# Altium schematic sheet SHIELD_W5500.SchDoc: W5500 ETHERNET SHIELD
size A3; DrawnBy: Aytac Dilek; Revision: V1.0
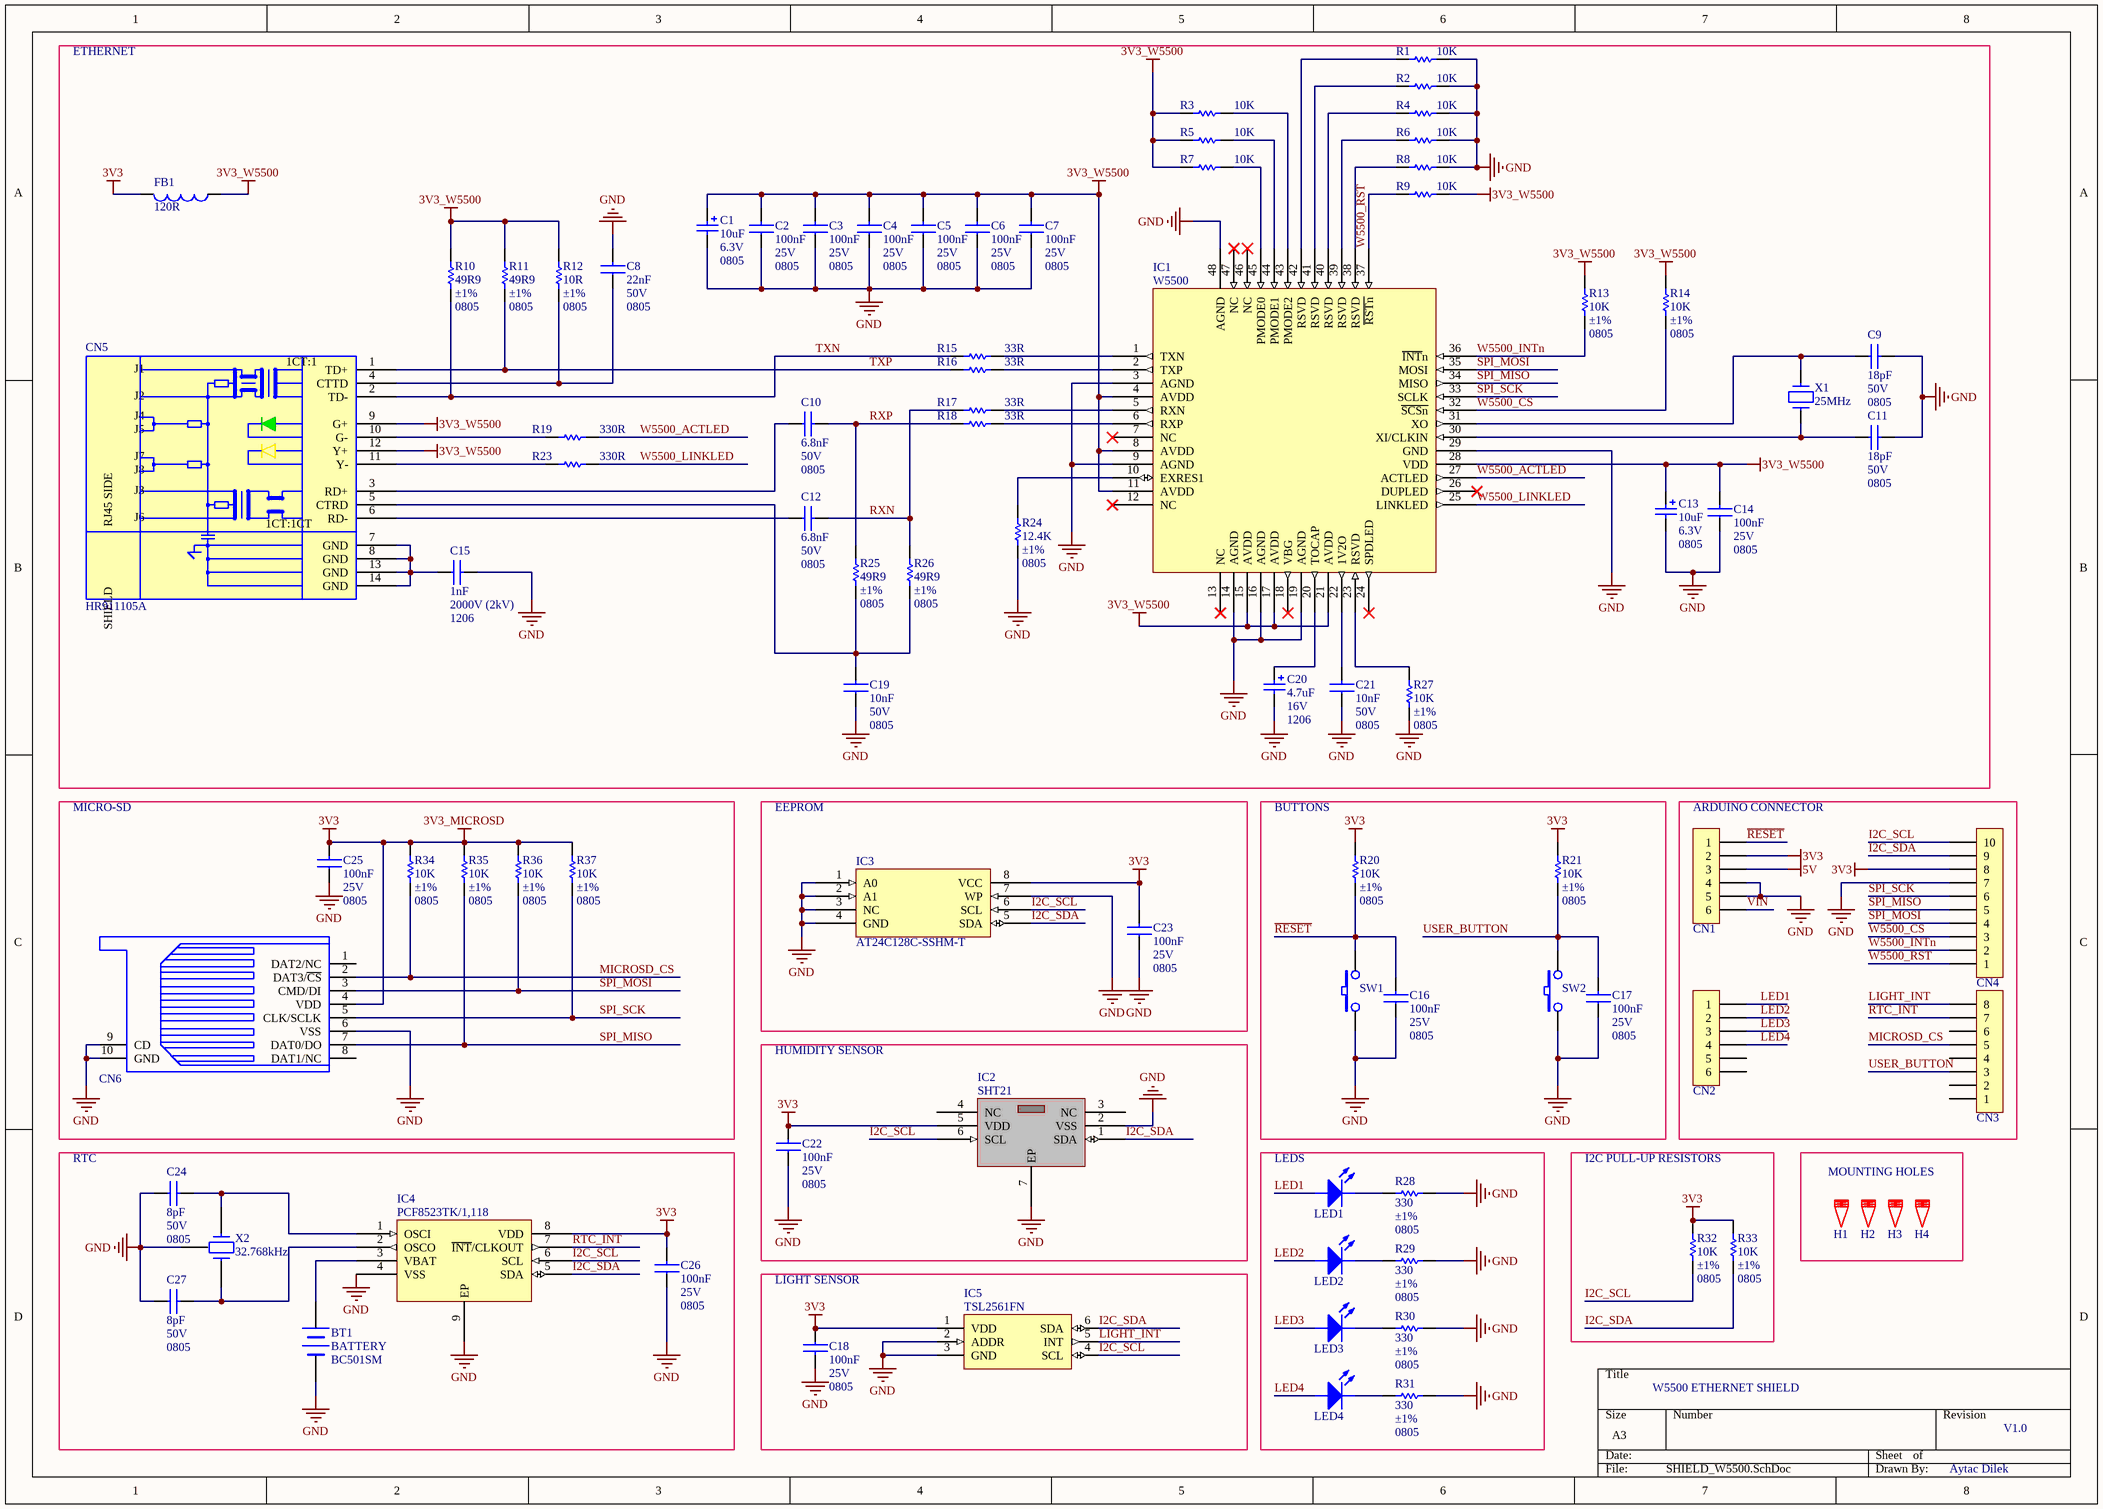
[diagram p0: SHIELD_W5500.SchDoc]

## Parts
BT1  BATTERY  Manufacturer Part Number: BC501SM  [MPD_BC501SM]
C1  value 10uF  Voltage - Rated: 6.3V  Package / Case: 0805  [CAPMP2013X12N_EIA-0805_CASE-R]  (hidden comment: CAP_P)
C2  Capacitance: 100nF  Voltage - Rated: 25V  Package / Case: 0805  [CAPC2012X100N_EIA0805]  (hidden comment: CAP_NP)
C3  Capacitance: 100nF  Voltage - Rated: 25V  Package / Case: 0805  [CAPC2012X100N_EIA0805]  (hidden comment: CAP_NP)
C4  Capacitance: 100nF  Voltage - Rated: 25V  Package / Case: 0805  [CAPC2012X100N_EIA0805]  (hidden comment: CAP_NP)
C5  Capacitance: 100nF  Voltage - Rated: 25V  Package / Case: 0805  [CAPC2012X100N_EIA0805]  (hidden comment: CAP_NP)
C6  Capacitance: 100nF  Voltage - Rated: 25V  Package / Case: 0805  [CAPC2012X100N_EIA0805]  (hidden comment: CAP_NP)
C7  Capacitance: 100nF  Voltage - Rated: 25V  Package / Case: 0805  [CAPC2012X100N_EIA0805]  (hidden comment: CAP_NP)
C8  Capacitance: 22nF  Voltage - Rated: 50V  Package / Case: 0805  [CAPC2012X100N_EIA0805]  (hidden comment: CAP_NP)
C9  Capacitance: 18pF  Voltage - Rated: 50V  Package / Case: 0805  [CAPC2012X100N_EIA0805]  (hidden comment: CAP_NP)
C10  Capacitance: 6.8nF  Voltage - Rated: 50V  Package / Case: 0805  [CAPC2012X100N_EIA0805]  (hidden comment: CAP_NP)
C11  Capacitance: 18pF  Voltage - Rated: 50V  Package / Case: 0805  [CAPC2012X100N_EIA0805]  (hidden comment: CAP_NP)
C12  Capacitance: 6.8nF  Voltage - Rated: 50V  Package / Case: 0805  [CAPC2012X100N_EIA0805]  (hidden comment: CAP_NP)
C13  value 10uF  Voltage - Rated: 6.3V  Package / Case: 0805  [CAPMP2013X12N_EIA-0805_CASE-R]  (hidden comment: CAP_P)
C14  Capacitance: 100nF  Voltage - Rated: 25V  Package / Case: 0805  [CAPC2012X100N_EIA0805]  (hidden comment: CAP_NP)
C15  value 1nF  Voltage - Rated: 2000V (2kV)  Package / Case: 1206  [CAPC3216X125N_EIA1206]  (hidden comment: CAP_NP)
C16  Capacitance: 100nF  Voltage - Rated: 25V  Package / Case: 0805  [CAPC2012X100N_EIA0805]  (hidden comment: CAP_NP)
C17  Capacitance: 100nF  Voltage - Rated: 25V  Package / Case: 0805  [CAPC2012X100N_EIA0805]  (hidden comment: CAP_NP)
C18  Capacitance: 100nF  Voltage - Rated: 25V  Package / Case: 0805  [CAPC2012X100N_EIA0805]  (hidden comment: CAP_NP)
C19  Capacitance: 10nF  Voltage - Rated: 50V  Package / Case: 0805  [CAPC2012X100N_EIA0805]  (hidden comment: CAP_NP)
C20  value 4.7uF  Voltage - Rated: 16V  Package / Case: 1206  [CAPMP3216X16N_EIA-1206_CASE-A]  (hidden comment: CAP_P)
C21  Capacitance: 10nF  Voltage - Rated: 50V  Package / Case: 0805  [CAPC2012X100N_EIA0805]  (hidden comment: CAP_NP)
C22  Capacitance: 100nF  Voltage - Rated: 25V  Package / Case: 0805  [CAPC2012X100N_EIA0805]  (hidden comment: CAP_NP)
C23  Capacitance: 100nF  Voltage - Rated: 25V  Package / Case: 0805  [CAPC2012X100N_EIA0805]  (hidden comment: CAP_NP)
C24  Capacitance: 8pF  Voltage - Rated: 50V  Package / Case: 0805  [CAPC2012X100N_EIA0805]  (hidden comment: CAP_NP)
C25  Capacitance: 100nF  Voltage - Rated: 25V  Package / Case: 0805  [CAPC2012X100N_EIA0805]  (hidden comment: CAP_NP)
C26  Capacitance: 100nF  Voltage - Rated: 25V  Package / Case: 0805  [CAPC2012X100N_EIA0805]  (hidden comment: CAP_NP)
C27  Capacitance: 8pF  Voltage - Rated: 50V  Package / Case: 0805  [CAPC2012X100N_EIA0805]  (hidden comment: CAP_NP)
CN1  HDR_1X6  [HDRFV6W70P254_1X6_1524X254X1118P]  (value not drawn)
CN2  HDR_1X6  [HDRFV6W70P254_1X6_1524X254X1118P]  (value not drawn)
CN3  HDR_1X8  [HDRFV8W70P254_1X8_2032X254X1118P]  (value not drawn)
CN4  HDR_1X10  [HDRFV10W70P254_1X10_2540X254X1118P]  (value not drawn)
CN5  HR911105A  [HANRUN_HR911105A]
CN6  MICRO-SD  [MICRO-SD-SELF-EJECT]  (value not drawn)
FB1  Impedance: 120R  [FILC2012X100N_EIA0805]  (hidden comment: BEAD)
H1  HOLES  [HOLE_125MIL]  (value not drawn)
H2  HOLES  [HOLE_125MIL]  (value not drawn)
H3  HOLES  [HOLE_125MIL]  (value not drawn)
H4  HOLES  [HOLE_125MIL]  (value not drawn)
IC1  W5500  [QFP50P900X900X160-48N]
IC2  SHT21  [SHT21]
IC3  Manufacturer Part Number: AT24C128C-SSHM-T  [SOIC127P600X175-8N]  (hidden comment: AT24C128)
IC4  PCF8523TK/1,118  [SON80P400X100_HS-9N_[NXP]SOT909-1]
IC5  Manufacturer Part Number: TSL2561FN  [DFN-6]  (hidden comment: TSL256x)
LED1  LED  [LEDC2012X70N_EIA0805_RED]  (value not drawn)
LED2  LED  [LEDC2012X70N_EIA0805_RED]  (value not drawn)
LED3  LED  [LEDC2012X70N_EIA0805_RED]  (value not drawn)
LED4  LED  [LEDC2012X70N_EIA0805_RED]  (value not drawn)
R1  value 10K  [RESC2013X65N_EIA0805]  (hidden comment: RES)
R2  value 10K  [RESC2013X65N_EIA0805]  (hidden comment: RES)
R3  value 10K  [RESC2013X65N_EIA0805]  (hidden comment: RES)
R4  value 10K  [RESC2013X65N_EIA0805]  (hidden comment: RES)
R5  value 10K  [RESC2013X65N_EIA0805]  (hidden comment: RES)
R6  value 10K  [RESC2013X65N_EIA0805]  (hidden comment: RES)
R7  value 10K  [RESC2013X65N_EIA0805]  (hidden comment: RES)
R8  value 10K  [RESC2013X65N_EIA0805]  (hidden comment: RES)
R9  value 10K  [RESC2013X65N_EIA0805]  (hidden comment: RES)
R10  value 49R9  Tolerance: ±1%  Package / Case: 0805  [RESC2013X65N_EIA0805]  (hidden comment: RES)
R11  value 49R9  Tolerance: ±1%  Package / Case: 0805  [RESC2013X65N_EIA0805]  (hidden comment: RES)
R12  value 10R  Tolerance: ±1%  Package / Case: 0805  [RESC2013X65N_EIA0805]  (hidden comment: RES)
R13  value 10K  Tolerance: ±1%  Package / Case: 0805  [RESC2013X65N_EIA0805]  (hidden comment: RES)
R14  value 10K  Tolerance: ±1%  Package / Case: 0805  [RESC2013X65N_EIA0805]  (hidden comment: RES)
R15  value 33R  [RESC2013X65N_EIA0805]  (hidden comment: RES)
R16  value 33R  [RESC2013X65N_EIA0805]  (hidden comment: RES)
R17  value 33R  [RESC2013X65N_EIA0805]  (hidden comment: RES)
R18  value 33R  [RESC2013X65N_EIA0805]  (hidden comment: RES)
R19  value 330R  [RESC2013X65N_EIA0805]  (hidden comment: RES)
R20  Resistance (Ohm): 10K  Tolerance: ±1%  Package / Case: 0805  [RESC2013X65N_EIA0805]  (hidden comment: RES)
R21  Resistance (Ohm): 10K  Tolerance: ±1%  Package / Case: 0805  [RESC2013X65N_EIA0805]  (hidden comment: RES)
R23  value 330R  [RESC2013X65N_EIA0805]  (hidden comment: RES)
R24  value 12.4K  Tolerance: ±1%  Package / Case: 0805  [RESC2013X65N_EIA0805]  (hidden comment: RES)
R25  value 49R9  Tolerance: ±1%  Package / Case: 0805  [RESC2013X65N_EIA0805]  (hidden comment: RES)
R26  value 49R9  Tolerance: ±1%  Package / Case: 0805  [RESC2013X65N_EIA0805]  (hidden comment: RES)
R27  value 10K  Tolerance: ±1%  Package / Case: 0805  [RESC2013X65N_EIA0805]  (hidden comment: RES)
R28  Resistance (Ohm): 330  Tolerance: ±1%  Package / Case: 0805  [RESC2013X65N_EIA0805]  (hidden comment: RES)
R29  Resistance (Ohm): 330  Tolerance: ±1%  Package / Case: 0805  [RESC2013X65N_EIA0805]  (hidden comment: RES)
R30  Resistance (Ohm): 330  Tolerance: ±1%  Package / Case: 0805  [RESC2013X65N_EIA0805]  (hidden comment: RES)
R31  Resistance (Ohm): 330  Tolerance: ±1%  Package / Case: 0805  [RESC2013X65N_EIA0805]  (hidden comment: RES)
R32  Resistance (Ohm): 10K  Tolerance: ±1%  Package / Case: 0805  [RESC2013X65N_EIA0805]  (hidden comment: RES)
R33  Resistance (Ohm): 10K  Tolerance: ±1%  Package / Case: 0805  [RESC2013X65N_EIA0805]  (hidden comment: RES)
R34  Resistance (Ohm): 10K  Tolerance: ±1%  Package / Case: 0805  [RESC2013X65N_EIA0805]  (hidden comment: RES)
R35  Resistance (Ohm): 10K  Tolerance: ±1%  Package / Case: 0805  [RESC2013X65N_EIA0805]  (hidden comment: RES)
R36  Resistance (Ohm): 10K  Tolerance: ±1%  Package / Case: 0805  [RESC2013X65N_EIA0805]  (hidden comment: RES)
R37  Resistance (Ohm): 10K  Tolerance: ±1%  Package / Case: 0805  [RESC2013X65N_EIA0805]  (hidden comment: RES)
SW1  SWITCH_TACTILE_2PIN  [C&K_RS-282G05A3-SM_RT]  (value not drawn)
SW2  SWITCH_TACTILE_2PIN  [C&K_RS-282G05A3-SM_RT]  (value not drawn)
X1  value 25MHz  [HC-49/US]  (hidden comment: CRYSTAL)
X2  value 32.768kHz  [32.768_DIP]  (hidden comment: CRYSTAL_32K)

## Blocks framed on the sheet
ETHERNET: C1-C15 C19-C21 CN5 FB1 IC1 R1-R19 R23-R27 X1
MICRO-SD: C25 CN6 R34-R37
EEPROM: C23 IC3
BUTTONS: C16 C17 R20 R21 SW1 SW2
ARDUINO CONNECTOR: CN1-CN4
HUMIDITY SENSOR: C22 IC2
RTC: BT1 C24 C26 C27 IC4 X2
LEDS: LED1-LED4 R28-R31
I2C PULL-UP RESISTORS: R32 R33
MOUNTING HOLES: H1-H4
LIGHT SENSOR: C18 IC5

## Nets
3V3: C18.1 C22.2 C23.2 C25.2 C26.2 CN1.2 CN4.8 CN6.4(VDD) FB1.2 IC2.5(VDD) IC3.8(VCC) IC4.8(VDD) IC5.1(VDD) R20.1 R21.1 R32.1 R33.1 R34.1 R35.1 R36.1 R37.1  [also labelled 3V3_MICROSD]
3V3_W5500: C1.1 C2.2 C3.2 C4.2 C5.2 C6.2 C7.2 C13.1 C14.2 CN5.9(G+) CN5.12(Y+) FB1.1 IC1.4(AVDD) IC1.8(AVDD) IC1.11(AVDD) IC1.15(AVDD) IC1.17(AVDD) IC1.21(AVDD) IC1.28(VDD) R3.2 R5.2 R7.2 R9.2 R10.1 R11.1 R12.1 R13.1 R14.1
5V: CN1.3
GND: BT1.2(-) C1.2 C2.1 C3.1 C4.1 C5.1 C6.1 C7.1 C8.2 C9.2 C11.2 C13.2 C14.1 C15.2 C16.1 C17.1 C18.2 C19.1 C20.2 C21.1 C22.1 C23.1 C24.1 C25.1 C26.1 C27.1 CN1.4 CN1.5 CN4.7 CN6.6(VSS) CN6.9(CD) CN6.10(GND) IC1.3(AGND) IC1.9(AGND) IC1.14(AGND) IC1.16(AGND) IC1.19(AGND) IC1.29(GND) IC1.48(AGND) IC2.2(VSS) IC2.7(EP) IC3.1(A0) IC3.2(A1) IC3.3(NC) IC3.4(GND) IC3.7(WP) IC4.4(VSS) IC4.9(EP) IC5.2(ADDR) IC5.3(GND) R1.2 R2.2 R4.2 R6.2 R8.2 R24.2 R27.2 R28.2 R29.1 R30.1 R31.1 SW1.1 SW2.1 X2.3
I2C_SCL: CN4.10 IC2.6(SCL) IC3.6(SCL) IC4.6(SCL) IC5.4(SCL) R32.2
I2C_SDA: CN4.9 IC2.1(SDA) IC3.5(SDA) IC4.5(SDA) IC5.6(SDA) R33.2
LED1: CN2.1 LED1.2
LED2: CN2.2 LED2.2
LED3: CN2.3 LED3.2
LED4: CN2.4 LED4.2
LIGHT_INT: CN3.8 IC5.5(INT)
MICROSD_CS: CN3.5 CN6.2(DAT3/~{CS}) R34.2
~{RESET}: C16.2 CN1.1 R20.2 SW1.2
RTC_INT: CN3.7 IC4.7(~{INT}/CLKOUT)
RXN: C12.2 R17.2 R26.1
RXP: C10.2 R18.2 R25.1
SPI_MISO: CN4.5 CN6.7(DAT0/DO) IC1.34(MISO) R35.2
SPI_MOSI: CN4.4 CN6.3(CMD/DI) IC1.35(MOSI) R36.2
SPI_SCK: CN4.6 CN6.5(CLK/SCLK) IC1.33(SCLK) R37.2
TXN: CN5.2(TD-) R10.2 R15.2
TXP: CN5.1(TD+) R11.2 R16.2
USER_BUTTON: C17.2 CN3.3 R21.2 SW2.2
VIN: CN1.6
W5500_ACTLED: IC1.27(ACTLED) R19.1
W5500_CS: CN4.3 IC1.32(~{SCSn}) R14.2
W5500_INTn: CN4.2 IC1.36(~{INT}n) R13.2
W5500_LINKLED: IC1.25(LINKLED) R23.1
W5500_RST: CN4.1 IC1.37(~{RSTn}) R9.1
NetBT1_1: BT1.1(+) IC4.3(VBAT)
NetC8_1: C8.1 CN5.4(CTTD) R12.2
NetC9_1: C9.1 IC1.31(XO) X1.1
NetC10_1: C10.1 CN5.3(RD+)
NetC11_1: C11.1 IC1.30(XI/CLKIN) X1.2
NetC12_1: C12.1 CN5.6(RD-)
NetC15_1: C15.1 CN5.7(GND) CN5.8(GND) CN5.13(GND) CN5.14(GND)
NetC19_2: C19.2 CN5.5(CTRD) R25.2 R26.2
NetC20_1: C20.1 IC1.20(TOCAP)
NetC21_2: C21.2 IC1.22(1V2O)
NetC24_2: C24.2 IC4.1(OSCI) X2.2
NetC27_2: C27.2 IC4.2(OSCO) X2.1
NetCN5_10: CN5.10(G-) R19.2
NetCN5_11: CN5.11(Y-) R23.2
NetIC1_1: IC1.1(TXN) R15.1
NetIC1_2: IC1.2(TXP) R16.1
NetIC1_5: IC1.5(RXN) R17.1
NetIC1_6: IC1.6(RXP) R18.1
NetIC1_10: IC1.10(EXRES1) R24.1
NetIC1_23: IC1.23(RSVD) R27.1
NetIC1_38: IC1.38(RSVD) R8.1
NetIC1_39: IC1.39(RSVD) R6.1
NetIC1_40: IC1.40(RSVD) R4.1
NetIC1_41: IC1.41(RSVD) R2.1
NetIC1_42: IC1.42(RSVD) R1.1
NetIC1_43: IC1.43(PMODE2) R3.1
NetIC1_44: IC1.44(PMODE1) R5.1
NetIC1_45: IC1.45(PMODE0) R7.1
NetLED1_1: LED1.1 R28.1
NetLED2_1: LED2.1 R29.2
NetLED3_1: LED3.1 R30.2
NetLED4_1: LED4.1 R31.2

Not connected (* = marked no-connect by the designer): CN2 5 6; CN3 1 2 4 6; CN6 1(DAT2/NC) 8(DAT1/NC); IC1 7(NC)* 12(NC)* 13(NC)* 18(VBG)* 24(SPDLED)* 26(DUPLED)* 46(NC)* 47(NC)*; IC2 3(NC) 4(NC)

## Notes on the sheet
- (in symbol SCON00127) 1CT:1; J1; J2; J4; J5; J7; RJ45 SIDE; J8; J3; J6; 1CT:1CT; SHIELD

## Library data of the parts
BT1 = SBAT00011: HOLDER COIN CELL FOR CR1220 SMD; Manufacturer: MPD (Memory Protection Devices); Value: BC501SM; Voltage: 3V; Battery Chemistry: Coin Cell, Holder; Battery Cell Size: Coin, 12.0mm; Cost x10 ($): 0.81000; Cost x100 ($): 0.73000; Cost x1000 ($): 0.59000; Distrubutor: Digikey; Lead Time: 12 Weeks; Cost x1 ($): 0.88000; Part Number: SBAT00011; Mounting Type: PCB, Surface Mount; Category: Battery Products; Family: Battery Holders, Clips, Contacts; Distributor Part Number: BC501SM-ND; ROHS: YES; Distributor Link: http://www.digikey.com/product-detail/en/mpd-memory-protection-devices/BC501SM/BC501SM-ND/2439260; Moisture Sensitivity Level (MSL): 1 (Unlimited); Quantity: 20
C1 C13 = SCAP01400004: CAP TANT 10UF 6.3V 10% 0805; Manufacturer: AVX Corporation; Manufacturer Part Number: TPSP106K006R1500; Capacitance: 10µF; ESR (Equivalent Series Resistance): 6 Ohm; Type: Molded; Cost x1 ($): 0.83; Cost x10 ($): 0.79600; Cost x100 ($): 0.38610; Cost x1000 ($): 0.26730; Distrubutor: Digikey; Part Number: SCAP01400004; Tolerance: ±10%; Operating Temperature: -55°C ~ 125°C; Category: Capacitors; Family: Tantalum Capacitors; Distributor Part Number: 478-9266-1-ND; Distributor Link: http://www.digikey.com/product-detail/en/TPSR106K006R1500/478-9266-1-ND/4562131; ROHS: YES; Quantity: 20
C2-C7 C14 C16-C18 C22 C23 C25 C26 = SCAP00300093: CAP CER 0.1UF 25V X7R 0805; Manufacturer: Samsung Electro-Mechanics America, Inc.; Manufacturer Part Number: CL21B104KACNNNC; Value: 100nF; Tolerance: ±10%; Type: Multi Layer Ceramic Capacitor  (MLCC); Cost x1 ($): 0.10000; Cost x10 ($): 0.03300; Cost x100 ($): 0.01470; Cost x1000 ($): 0.00825; Distrubutor: Digikey; Lead Time: 11 Weeks; Part Number: SCAP00300093; Temperature Coefficient: X7R; Operating Temperature: -55°C ~ 125°C; Mounting Type: Surface Mount, MLCC; Size / Dimension: 0.079" L x 0.049" W (2.00mm x 1.25mm); Category: Capacitors; Family: Ceramic Capacitors; Distributor Part Number: 1276-1099-1-ND; Distributor Link: http://www.digikey.com/product-detail/en/samsung-electro-mechanics-america-inc/CL21B104KACNNNC/1276-1099-1-ND/3889185; ROHS: YES; Moisture Sensitivity Level (MSL): 1 (Unlimited); Quantity: 50
C8 = SCAP00300087: CAP CER 0.022UF 50V X7R 0805; Manufacturer: Samsung Electro-Mechanics America, Inc.; Manufacturer Part Number: CL21B223KBANNNC; Value: 22nF; Tolerance: ±10%; Type: Multi Layer Ceramic Capacitor  (MLCC); Cost x1 ($): 0.10000; Cost x10 ($): 0.05800; Cost x100 ($): 0.02600; Cost x1000 ($): 0.01458; Distrubutor: Digikey; Lead Time: 11 Weeks; Part Number: SCAP00300087; Temperature Coefficient: X7R; Operating Temperature: -55°C ~ 125°C; Mounting Type: Surface Mount, MLCC; Size / Dimension: 0.079" L x 0.049" W (2.00mm x 1.25mm); Category: Capacitors; Family: Ceramic Capacitors; Distributor Part Number: 1276-1081-1-ND; Distributor Link: http://www.digikey.com/product-detail/en/samsung-electro-mechanics-america-inc/CL21B223KBANNNC/1276-1081-1-ND/3889167; ROHS: YES; Moisture Sensitivity Level (MSL): 1 (Unlimited); Quantity: 50
C9 C11 = SCAP00300040: CAP CER 18PF 50V NP0 0805; Manufacturer: Samsung Electro-Mechanics America, Inc.; Manufacturer Part Number: CL21C180JBANNNC; Tolerance: ±5%; Temperature Coefficient: C0G, NP0; Type: Multi Layer Ceramic Capacitor  (MLCC); Cost x1 ($): 0.10000; Cost x10 ($): 0.04400; Cost x100 ($): 0.01960; Cost x1000 ($): 0.01100; Distrubutor: Digikey; Lead Time: 11 Weeks; Part Number: SCAP00300040; Value: 18pF; Operating Temperature: -55°C ~ 125°C; Mounting Type: Surface Mount, MLCC; Size / Dimension: 0.079" L x 0.049" W (2.00mm x 1.25mm); Category: Capacitors; Family: Ceramic Capacitors; Distributor Part Number: 1276-1107-1-ND; Distributor Link: http://www.digikey.com/product-detail/en/samsung-electro-mechanics-america-inc/CL21C180JBANNNC/1276-1107-1-ND/3889193; ROHS: YES; Moisture Sensitivity Level (MSL): 1 (Unlimited); Quantity: 50
C10 C12 = SCAP00300083: CAP CER 6800PF 50V X7R 0805; Manufacturer: Samsung Electro-Mechanics America, Inc.; Manufacturer Part Number: CL21B682KBANNNC; Value: 6.8nF; Tolerance: ±10%; Type: Multi Layer Ceramic Capacitor  (MLCC); Cost x1 ($): 0.10000; Cost x10 ($): 0.05100; Cost x100 ($): 0.02280; Cost x1000 ($): 0.01279; Distrubutor: Digikey; Lead Time: 11 Weeks; Part Number: SCAP00300083; Temperature Coefficient: X7R; Operating Temperature: -55°C ~ 125°C; Mounting Type: Surface Mount, MLCC; Size / Dimension: 0.079" L x 0.049" W (2.00mm x 1.25mm); Category: Capacitors; Family: Ceramic Capacitors; Distributor Part Number: 1276-1799-1-ND; Distributor Link: http://www.digikey.com/product-detail/en/samsung-electro-mechanics-america-inc/CL21B682KBANNNC/1276-1799-1-ND/3889885; ROHS: YES; Moisture Sensitivity Level (MSL): 1 (Unlimited); Quantity: 50
C15 = SCAP00410036: CAP CER 1000PF 2KV X7R 1206; Manufacturer: Johanson Dielectrics Inc.; Manufacturer Part Number: 202R18W102KV4E; Tolerance: ±10%; Type: Multi Layer Ceramic Capacitor  (MLCC); Cost x1 ($): 0.12000; Cost x10 ($): 0.08600; Cost x100 ($): 0.04070; Cost x1000 ($): 0.02361; Distrubutor: Digikey; Lead Time: 8 Weeks; Part Number: SCAP00410036; Capacitance: 1000pF; Temperature Coefficient: X7R; Operating Temperature: -55°C ~ 125°C; Mounting Type: Surface Mount, MLCC; Size / Dimension: 0.125" L x 0.062" W (3.17mm x 1.57mm); Category: Capacitors; Family: Ceramic Capacitors; Distributor Part Number: 709-1036-1-ND; Distributor Link: http://www.digikey.com/product-detail/en/johanson-dielectrics-inc/202R18W102KV4E/709-1036-1-ND/1556441; ROHS: YES; Moisture Sensitivity Level (MSL): 1 (Unlimited); Quantity: 0
C19 C21 = SCAP00300085: CAP CER 10000PF 50V X7R 0805; Manufacturer: Samsung Electro-Mechanics America, Inc.; Manufacturer Part Number: CL21B103KBANNNC; Value: 10nF; Tolerance: ±10%; Type: Multi Layer Ceramic Capacitor  (MLCC); Cost x1 ($): 0.10000; Cost x10 ($): 0.02700; Cost x100 ($): 0.01210; Cost x1000 ($): 0.00677; Distrubutor: Digikey; Lead Time: 11 Weeks; Part Number: SCAP00300085; Temperature Coefficient: X7R; Operating Temperature: -55°C ~ 125°C; Mounting Type: Surface Mount, MLCC; Size / Dimension: 0.079" L x 0.049" W (2.00mm x 1.25mm); Category: Capacitors; Family: Ceramic Capacitors; Distributor Part Number: 1276-1015-1-ND; Distributor Link: http://www.digikey.com/product-detail/en/samsung-electro-mechanics-america-inc/CL21B103KBANNNC/1276-1015-1-ND/3889101; ROHS: YES; Moisture Sensitivity Level (MSL): 1 (Unlimited); Quantity: 50
C20 = SCAP01400003: CAP TANT 4.7UF 16V 10% 1206; Manufacturer: AVX Corporation; Manufacturer Part Number: TAJA475K016RNJ; Capacitance: 4.7µF; ESR (Equivalent Series Resistance): 4 Ohm; Type: Molded; Cost x1 ($): 0.56000; Cost x10 ($): 0.53600; Cost x100 ($): 0.26000; Cost x1000 ($): 0.18000; Distrubutor: Digikey; Part Number: SCAP01400003; Tolerance: ±10%; Operating Temperature: -55°C ~ 125°C; Category: Capacitors; Family: Tantalum Capacitors; Distributor Part Number: 478-3868-1-ND; Distributor Link: http://www.digikey.com/product-detail/en/TAJA475K016RNJ/478-3868-1-ND/1126914; ROHS: YES; Quantity: 20
C24 C27 = SCAP00300030: CAP CER 8PF 50V NP0 0805; Manufacturer: Samsung Electro-Mechanics America, Inc.; Manufacturer Part Number: CL21C080CBANNNC; Tolerance: ±0.25pF; Temperature Coefficient: C0G, NP0; Type: Multi Layer Ceramic Capacitor  (MLCC); Cost x1 ($): 0.10000; Cost x10 ($): 0.01900; Cost x100 ($): 0.00860; Cost x1000 ($): 0.00481; Distrubutor: Digikey; Lead Time: 11 Weeks; Part Number: SCAP00300030; Value: 8pF; Operating Temperature: -55°C ~ 125°C; Mounting Type: Surface Mount, MLCC; Size / Dimension: 0.079" L x 0.049" W (2.00mm x 1.25mm); Category: Capacitors; Family: Ceramic Capacitors; Distributor Part Number: 1276-2556-1-ND; Distributor Link: http://www.digikey.com/product-detail/en/samsung-electro-mechanics-america-inc/CL21C080CBANNNC/1276-2556-1-ND/3890642; ROHS: YES; Moisture Sensitivity Level (MSL): 1 (Unlimited); Quantity: 50
CN1 CN2 = SCON00124: CONN ARDUINO HEADER .0100" 6POS; Pitch: 2.54mm; Distrubutor: Digikey; Part Number: SCON00124; Value: HDR_1X6; Category: Connectors, Interconnects; Family: Rectangular Connectors - Headers, Receptacles, Female Sockets; Connector Type: Header; Contact Type: Female Socket; Mounting Type: Through Hole
CN3 = SCON00125: CONN ARDUINO HEADER .0100" 8POS; Pitch: 2.54mm; Distrubutor: Digikey; Part Number: SCON00125; Value: HDR_1X8; Category: Connectors, Interconnects; Family: Rectangular Connectors - Headers, Receptacles, Female Sockets; Connector Type: Header; Contact Type: Female Socket; Mounting Type: Through Hole
CN4 = SCON00126: CONN ARDUINO HEADER .0100" 10POS; Pitch: 2.54mm; Distrubutor: Digikey; Part Number: SCON00126; Value: HDR_1X10; Category: Connectors, Interconnects; Family: Rectangular Connectors - Headers, Receptacles, Female Sockets; Connector Type: Header; Contact Type: Female Socket; Mounting Type: Through Hole
CN5 = SCON00127: CONN MAGJACK 1PORT 100 BASE-T; Connector Type: RJ45; Distrubutor: Digikey; Part Number: SCON00127; Value: HR911105A; Category: Connectors, Interconnects; Family: Modular Connectors - Jacks With Magnetics; Mounting Type: Through Hole; Quantity: 10
CN6 = SCON00094: CONN MICRO SD CARD PUSH-PUSH R/A; Manufacturer: TransFlash; Connector Type: Connector and Ejector; Cost (x1): $0.284; Part Number: SCON00094; Value: MICRO-SD; Category: Connectors, Interconnects; Family: Memory Connectors - PC Cards - Secure Digital - microSD™; Mounting Type: SMD; ROHS: YES; Quantity: 10
FB1 = SFIL00005: FERRITE CHIP POWER 120 OHM SMD; Manufacturer: Laird-Signal Integrity Products; Manufacturer Part Number: HI0805O121R-10; Type: Differential Mode - Single; Current Rating: 3.5A; DC Resistance (DCR): 20 mOhm Max; Cost x10 ($): 0.08700; Cost x100 ($): 0.05230; Cost x1000 ($): 0.03010; Distrubutor: Digikey; Cost x1 ($): 0.10000; Part Number: SFIL00005; Package / Case: 0805 (2012 Metric); Value: BEAD; Category: Filters; Family: Ferrite Beads and Chips; Distributor Part Number: 240-2393-1-ND; ROHS: YES; Datasheet Link: http://www.digikey.com/product-detail/en/HI0805O121R-10/240-2393-1-ND/806753; Quantity: 50
H1-H4 = SMSC00005: Value: HOLE_125MIL; Part Number: SMSC00005
IC1 = SIC00138: IC CTLR 3-1 ETH TCP/IP 48LQFP; Manufacturer: WIZnet; Vin: 2.97 V ~ 3.63 V; Protocol: SPI; Iin: 132mA; Cost x10 ($): 3.72500; Cost x100 ($): 3.05450; Cost x1000 ($): 2.08600; Distrubutor: Digikey; Lead Time: 8 Weeks; Cost x1 ($): 4.17000; Part Number: SIC00138; Manufacturer Part Number: W5500; Value: W5500; Operating Temperature: -40°C ~ 85°C; Category: Integrated Circuits (ICs); Family: Interface - Controllers; Package / Case: 48-LQFP (7x7); Type: Ethernet; Distributor Part Number: 1278-1021-ND; ROHS: YES; Distributor Link: http://www.digikey.com/product-detail/en/wiznet/W5500/1278-1021-ND/4425702; MSL: 3 (168 Hours); Quantity: 0
IC2 = SSEN00014: HUMIDITY AND TEMPERATURE SENSOR; Manufacturer: Sensirion AG; Voltage: 2.1 V ~ 3.6 V; Output Type: I²C; Sensor Type: Humidity, Temperature; Cost x10($): 7.07900; Cost x100 ($): 5.03360; Distrubutor: DigiKey; Lead Time: 4 Weeks; Cost x1 ($): 8.97000; Part Number: SSEN00014; Value: SHT21; Operating Temperature: -40°C ~ 125°C; Category: Sensors, Transducers; Family: Moisture Sensors, Humidity; Cost x1000 ($): 5.03360; Manufacturer Part Number: SHT21; Distributor Part Number: 1649-1005-1-ND; ROHS: YES; Distributor Link: http://www.digikey.com/product-detail/en/sensirion-ag/SHT21/1649-1005-1-ND/5872287; MSL: 1 (Unlimited); Quantity: 0
IC3 = SMEM00014: IC EEPROM 128KBIT 1MHZ 8SOIC; Manufacturer: Atmel; Voltage: 1.7 V ~ 5.5 V; Memory Size: 128K (16K x 8); Speed: 400kHz, 1MHz; Interface: I²C, 2-Wire Serial; Format - Memory: EEPROMs - Serial; Cost (x10): 0.58600; Cost (x100): 0.51410; Cost (x1000): 0.48411; Distrubutor: Digikey; Lead Time: 5 Weeks; Cost $ (x1): 0.64000; Part Number: SMEM00014; Value: AT24C128; Package: SMD; Category: Integrated Circuits (ICs); Family: Memory; Memory Type: EEPROM; Package / Case: 8-SOIC (0.154", 3.90mm Width); Distributor Part Number: AT24C128C-SSHM-TCT-ND; Distributor Link: http://www.digikey.com/product-detail/en/atmel/AT24C128C-SSHM-T/AT24C128C-SSHM-TCT-ND/3178459; ROHS: YES; Quantity: 10
IC4 = SIC00133: IC RTC CLK/CALENDAR I2C 8-HVSON; Manufacturer: NXP Semiconductors; Vin: 1.6 V ~ 5.5 V; Protocol: I²C, 2-Wire Serial; Iin: 0.5µA @ 2V ~ 5V; Cost x10 ($): 1.19200; Cost x100 ($): 0.92900; Cost x1000 ($): 0.60760; Distrubutor: Digikey; Lead Time: 7 Weeks; Cost x1 ($): 1.33000; Part Number: SIC00133; Manufacturer Part Number: PCF8523TK/1,118; Value: PCF8523; Operating Temperature: -40°C ~ 85°C; Category: Integrated Circuits (ICs); Family: Clock/Timing - Real Time Clocks; Package / Case: 8-VDFN Exposed Pad, 8-HVSON (4x4); Type: Clock/Calendar; Distributor Part Number: 568-6648-1-ND; ROHS: YES; Distributor Link: http://www.digikey.com/product-detail/en/nxp-semiconductors/PCF8523TK-1,118/568-6648-1-ND/2617087; MSL: 1 (Unlimited); Quantity: 5
IC5 = SSEN00013: IC LIGHT TO DGTL CONV 6-DFN; Manufacturer: AMS-TAOS USA Inc.; Value: TSL2561FN; Voltage: 2.7 V ~ 3.6 V; Output Type: I²C; Cost x10($): 1.94700; Cost x100 ($): 1.29800; Cost x1000 ($): 1.00595; Distrubutor: DigiKey; Cost x1 ($): 2.40000; Part Number: SSEN00013; Operating Temperature: -30°C ~ 70°C; Category: Sensors, Transducers; Family: Optical Sensors - Ambient Light, IR, UV Sensors; Package / Case: 6-WDFN; Distributor Part Number: TSL2561-FNCT-ND; ROHS: YES; Distributor Link: http://www.digikey.com/product-detail/en/ams-taos-usa-inc/TSL2561FN/TSL2561-FNCT-ND/3095298; Quantity: 0
LED1-LED4 = SOPT00004: LED SUPER RED CLR THIN 0805 SMD; Manufacturer: Lite-On Inc; Manufacturer Part Number: LTST-C171KRKT; Value: LED_RED; Cost x10 ($): 0.24800; Cost x100 ($): 0.13500; Cost x1000 ($): 0.05850; Distrubutor: Digikey; Cost x1 ($): 0.32000; Part Number: SOPT00004; Package / Case: 0805 (2012 Metric); Category: Optoelectronics; Family: LED Indication - Discrete; Type: LED; Distributor Part Number: 160-1427-1-ND; ROHS: YES; Datasheet Link: http://www.digikey.com/product-detail/en/LTST-C171KRKT/160-1427-1-ND/386800; Quantity: 110
R1-R9 R13 R14 R20 R21 R27 R32-R37 = SRES03010098: RES SMD 10K OHM 1% 1/8W 0805; Manufacturer: Yageo; Manufacturer Part Number: RC0805FR-0710KL; Power (Watts): 0.125W, 1/8W; Cost x1 ($): 0.10; Cost x10 ($): 0.21; Cost x100 ($): 0.84; Cost x1000 ($): 3.79; Distrubutor: Digikey; Part Number: SRES03010098; Category: Resistors; Family: Chip Resistor - Surface Mount; Distributor Part Number: 311-10.0KCRCT-ND; Distributor Link: http://www.digikey.com/product-detail/en/RC0805FR-0710KL/311-10.0KCRCT-ND/730482; ROHS: YES; Quantity: 0
  R1-R9: Tolerance: ±1%; Package / Case: 0805; Resistance (Ohm): 10K
  R13 R14 R27: Resistance (Ohm): 10K
  R20 R21 R32-R37: Value: 10K
R10 R11 R25 R26 = SRES03030081: RES SMD 49.9 OHM 1% 1/8W 0805; Manufacturer: Samsung Electro-Mechanics America, Inc.; Manufacturer Part Number: RC2012F49R9CS; Resistance (Ohm): 49.9; Power (Watts): 0.125W, 1/8W; Cost x1 ($): 0.10000; Cost x10 ($): 0.02200; Cost x100 ($): 0.00910; Cost x1000 ($): 0.00408; Distrubutor: Digikey; Part Number: SRES03030081; Category: Resistors; Family: Chip Resistor - Surface Mount; Distributor Part Number: 1276-5210-1-ND; Distributor Link: http://www.digikey.com/product-detail/en/samsung-electro-mechanics-america-inc/RC2012F49R9CS/1276-5210-1-ND/3968182; ROHS: YES; Quantity: 0
R12 = SRES03010026: RES SMD 10 OHM 1% 1/8W 0805; Manufacturer: Yageo; Manufacturer Part Number: RC0805FR-0710RL; Resistance (Ohm): 10; Power (Watts): 0.125W, 1/8W; Cost x1 ($): 0.10; Cost x10 ($): 0.21; Cost x100 ($): 0.84; Cost x1000 ($): 3.79; Distrubutor: Digikey; Part Number: SRES03010026; Category: Resistors; Family: Chip Resistor - Surface Mount; Distributor Part Number: 311-10.0CRCT-ND; Distributor Link: http://www.digikey.com/product-detail/en/RC0805FR-0710RL/311-10.0CRCT-ND/730481; ROHS: YES; Quantity: 0
R15-R18 = SRES03010038: RES SMD 33 OHM 1% 1/8W 0805; Manufacturer: Yageo; Manufacturer Part Number: RC0805FR-0733RL; Resistance (Ohm): 33; Power (Watts): 0.125W, 1/8W; Cost x1 ($): 0.10; Cost x10 ($): 0.21; Cost x100 ($): 0.84; Cost x1000 ($): 3.79; Distrubutor: Digikey; Part Number: SRES03010038; Tolerance: ±1%; Package / Case: 0805; Category: Resistors; Family: Chip Resistor - Surface Mount; Distributor Part Number: 311-33.0CRCT-ND; Distributor Link: http://www.digikey.com/product-detail/en/RC0805FR-0733RL/311-33.0CRCT-ND/730809; ROHS: YES; Quantity: 0
R19 R23 = SRES03010062: RES SMD 330 OHM 1% 1/8W 0805; Manufacturer: Yageo; Manufacturer Part Number: RC0805FR-07330RL; Resistance (Ohm): 330; Power (Watts): 0.125W, 1/8W; Cost x1 ($): 0.10; Cost x10 ($): 0.21; Cost x100 ($): 0.84; Cost x1000 ($): 3.79; Distrubutor: Digikey; Part Number: SRES03010062; Tolerance: ±1%; Package / Case: 0805; Category: Resistors; Family: Chip Resistor - Surface Mount; Distributor Part Number: 311-330CRCT-ND; Distributor Link: http://www.digikey.com/product-detail/en/RC0805FR-07330RL/311-330CRCT-ND/730813; ROHS: YES; Quantity: 0
R24 = SRES03010171: RES SMD 12.4K OHM 1% 1/8W 0805; Manufacturer: Yageo; Manufacturer Part Number: RC0805FR-0712K4L; Power (Watts): 0.125W, 1/8W; Cost x1 ($): 0.10000; Cost x10 ($): 0.02100; Cost x100 ($): 0.00840; Cost x1000 ($): 0.00379; Distrubutor: Digikey; Lead Time: 22 Weeks; Part Number: SRES03010171; Resistance (Ohm): 12.4K; Category: Resistors; Family: Chip Resistor - Surface Mount; Distributor Part Number: 311-12.4KCRCT-ND; Distributor Link: http://www.digikey.com/product-detail/en/yageo/RC0805FR-0712K4L/311-12.4KCRCT-ND/730519; ROHS: YES; Moisture Sensitivity Level (MSL): 1 (Unlimited); Quantity: 0
R28-R31 = SRES03010062: RES SMD 330 OHM 1% 1/8W 0805; Manufacturer: Yageo; Manufacturer Part Number: RC0805FR-07330RL; Value: 330R; Power (Watts): 0.125W, 1/8W; Cost x1 ($): 0.10; Cost x10 ($): 0.21; Cost x100 ($): 0.84; Cost x1000 ($): 3.79; Distrubutor: Digikey; Part Number: SRES03010062; Category: Resistors; Family: Chip Resistor - Surface Mount; Distributor Part Number: 311-330CRCT-ND; Distributor Link: http://www.digikey.com/product-detail/en/RC0805FR-07330RL/311-330CRCT-ND/730813; ROHS: YES; Quantity: 0
SW1 SW2 = SSWI00022: SWITCH TACTILE SPST-NO 0.05A 12V; Manufacturer: C&K Components; Manufacturer Part Number: RS-282G05A3-SM RT; Value: SWITCH_TACTILE_MICRO_2PIN; Voltage: 12VDC; Cost x10 ($): 0.72900; Cost x100 ($): 0.55000; Cost x1000 ($): 0.39875; Distrubutor: Digikey; Lead Time: 10 Weeks; Cost x1 ($): 0.76000; Part Number: SSWI00022; Current: 0.05A; Package: SMD; Category: Switches; Family: Tactile Switches; Circuit: SPST-NO; Distributor Part Number: CKN10384CT-ND; Distrubutor Link: http://www.digikey.com/product-detail/en/c-k-components/RS-282G05A3-SM-RT/CKN10384CT-ND/2747203; ROHS: YES; Moisture Sensitivity Level (MSL): 1 (Unlimited); Datasheet Link: 0
X1 = SCRY00016: CRYSTAL 25.0000MHZ 18PF T/H; Manufacturer: CTS-Frequency Controls; Manufacturer Part Number: ATS250B-E; Frequency Tolerance: ±30ppm; ESR: 30 Ohm; Cost x10 ($): 0.30000; Cost x100 ($): 0.24000; Cost x1000 ($): 0.19200; Distrubutor: Digikey; Lead Time: 6 Weeks; Cost x1 ($): 0.36000; Part Number: SCRY00016; Mounting Type: Through Hole; Load Capacitance: 18pF; Package / Case: HC49/US; Type: MHz Crystal; Distributor Part Number: CTX928-ND; ROHS: YES; Datasheet Link: http://www.digikey.com/product-detail/en/cts-frequency-controls/ATS250B-E/CTX928-ND/2292924; Quantity: 20
X2 = SCRY00009: CRYSTAL 32.768KHZ 6PF THRU; Manufacturer: Seiko Instruments; Manufacturer Part Number: VT200F-6PF20PPM; ESR: 50 kOhm; Cost (x10): 0.25000; Cost (x100): 0.20000; Cost (x1000): 0.16000; Distrubutor: Digikey; Cost (x1): 0.30000; Part Number: SCRY00009; Mounting Type: Through Hole; Load Capacitance: 6pF; Package / Case: Cylindrical Can, Radial; Type: kHz Crystal (Tuning Fork); Distributor Part Number: 728-1000-ND; Datasheet Link: http://www.digikey.com/product-detail/en/VT200F-6PF20PPM/728-1000-ND/1626715